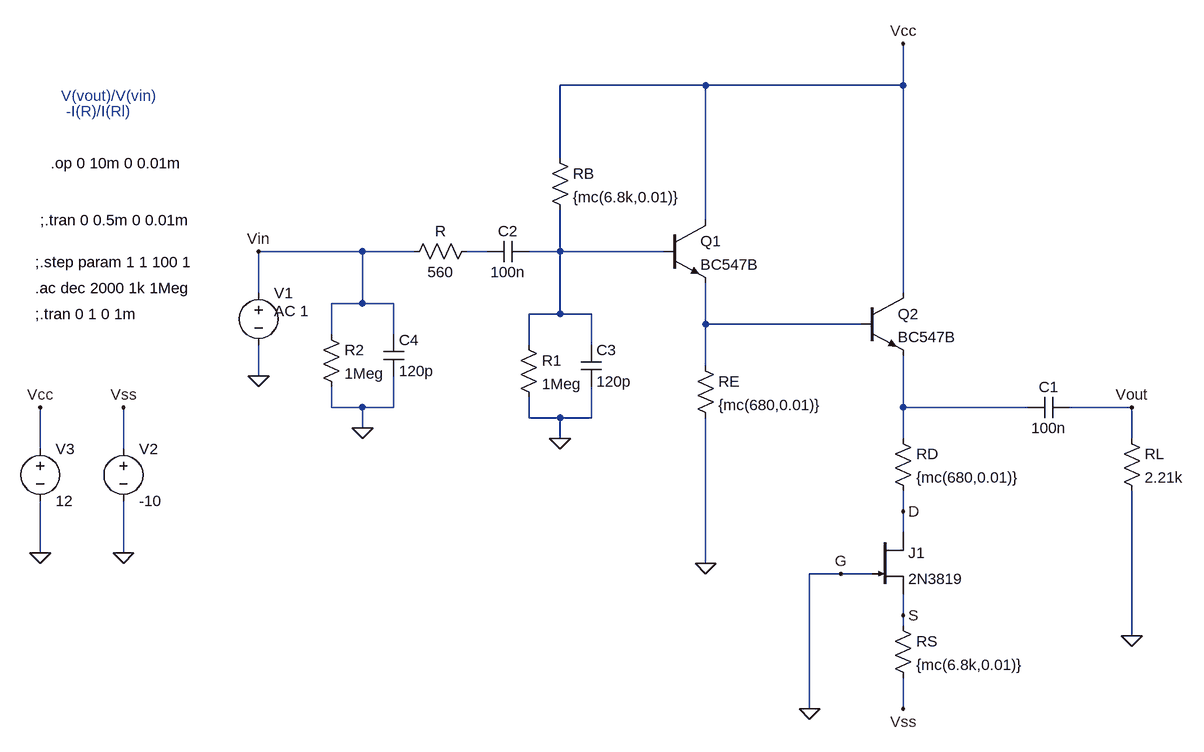
[diagram p0: schematic Darlington.asc]
Darlington.asc, the LTspice schematic file:
Version 4
SHEET 1 968 680
WIRE 192 -576 -32 -576
WIRE 496 -576 496 -640
WIRE 496 -576 192 -576
WIRE -32 -464 -32 -576
WIRE 192 -368 192 -576
WIRE -336 -320 -496 -320
WIRE -256 -320 -336 -320
WIRE -144 -320 -176 -320
WIRE -32 -320 -32 -384
WIRE -32 -320 -80 -320
WIRE 128 -320 -32 -320
WIRE -496 -256 -496 -320
WIRE 496 -256 496 -576
WIRE -336 -240 -336 -320
WIRE -336 -240 -384 -240
WIRE -288 -240 -336 -240
WIRE -32 -224 -32 -320
WIRE -32 -224 -80 -224
WIRE 16 -224 -32 -224
WIRE 192 -208 192 -272
WIRE 432 -208 192 -208
WIRE -384 -192 -384 -240
WIRE -288 -192 -288 -240
WIRE -80 -176 -80 -224
WIRE 16 -176 16 -224
WIRE 192 -144 192 -208
WIRE -496 -128 -496 -176
WIRE -384 -80 -384 -112
WIRE -336 -80 -384 -80
WIRE -288 -80 -288 -128
WIRE -288 -80 -336 -80
WIRE 496 -80 496 -160
WIRE 688 -80 496 -80
WIRE 848 -80 752 -80
WIRE -80 -64 -80 -96
WIRE -32 -64 -80 -64
WIRE 16 -64 16 -112
WIRE 16 -64 -32 -64
WIRE -336 -48 -336 -80
WIRE -32 -32 -32 -64
WIRE 496 -32 496 -80
WIRE 848 -32 848 -80
WIRE -832 -16 -832 -80
WIRE -704 -16 -704 -80
WIRE 496 80 496 48
WIRE 496 112 496 80
WIRE -832 144 -832 64
WIRE -704 144 -704 64
WIRE 192 160 192 -64
WIRE 400 176 352 176
WIRE 448 176 400 176
WIRE 496 240 496 208
WIRE 496 256 496 240
WIRE 848 272 848 48
WIRE 352 384 352 176
WIRE 496 384 496 336
FLAG 352 384 0
FLAG 496 384 Vss
FLAG -704 -80 Vss
FLAG -704 144 0
FLAG -832 -80 Vcc
FLAG -832 144 0
FLAG 496 -640 Vcc
FLAG 192 160 0
FLAG 848 272 0
FLAG -496 -128 0
FLAG -496 -320 Vin
FLAG 848 -80 Vout
FLAG 496 240 S
FLAG 496 80 D
FLAG 400 176 G
FLAG -32 -32 0
FLAG -336 -48 0
SYMBOL njf 448 112 R0
SYMATTR InstName J1
SYMATTR Value 2N3819
SYMBOL res 480 -48 R0
SYMATTR InstName RD
SYMATTR Value {mc(680,0.01)}
SYMATTR SpiceLine tol=1
SYMBOL res 480 240 R0
SYMATTR InstName RS
SYMATTR Value {mc(6.8k,0.01)}
SYMATTR SpiceLine tol=1
SYMBOL voltage -704 -32 R0
WINDOW 123 0 0 Left 0
WINDOW 39 0 0 Left 0
SYMATTR InstName V2
SYMATTR Value -10
SYMBOL npn 128 -368 R0
SYMATTR InstName Q1
SYMATTR Value BC547B
SYMBOL npn 432 -256 R0
SYMATTR InstName Q2
SYMATTR Value BC547B
SYMBOL res -48 -480 R0
SYMATTR InstName RB
SYMATTR Value {mc(6.8k,0.01)}
SYMATTR SpiceLine tol=1
SYMBOL res 176 -160 R0
SYMATTR InstName RE
SYMATTR Value {mc(680,0.01)}
SYMATTR SpiceLine tol=1
SYMBOL voltage -832 -32 R0
WINDOW 123 0 0 Left 0
WINDOW 39 0 0 Left 0
SYMATTR InstName V3
SYMATTR Value 12
SYMBOL cap 752 -96 R90
WINDOW 0 0 32 VBottom 2
WINDOW 3 32 32 VTop 2
SYMATTR InstName C1
SYMATTR Value 100n
SYMBOL res 832 -48 R0
SYMATTR InstName RL
SYMATTR Value 2.21k
SYMBOL res -160 -336 R90
WINDOW 0 0 56 VBottom 2
WINDOW 3 32 56 VTop 2
SYMATTR InstName R
SYMATTR Value 560
SYMBOL cap -80 -336 R90
WINDOW 0 0 32 VBottom 2
WINDOW 3 32 32 VTop 2
SYMATTR InstName C2
SYMATTR Value 100n
SYMBOL voltage -496 -272 R0
WINDOW 123 24 44 Left 2
WINDOW 39 0 0 Left 0
SYMATTR InstName V1
SYMATTR Value ""
SYMATTR Value2 AC 1
SYMBOL res -96 -192 R0
SYMATTR InstName R1
SYMATTR Value 1Meg
SYMBOL cap 0 -176 R0
SYMATTR InstName C3
SYMATTR Value 120p
SYMBOL res -400 -208 R0
SYMATTR InstName R2
SYMATTR Value 1Meg
SYMBOL cap -304 -192 R0
SYMATTR InstName C4
SYMATTR Value 120p
TEXT -840 -304 Left 2 !;.step param 1 1 100 1
TEXT -840 -224 Left 2 !;.tran 0 1 0 1m
TEXT -840 -264 Left 2 !.ac dec 2000 1k 1Meg
TEXT -800 -560 Left 2 ;V(vout)/V(vin)
TEXT -792 -536 Left 2 ;-I(R)/I(Rl)
TEXT -832 -368 Left 2 !;.tran 0 0.5m 0 0.01m
TEXT -816 -456 Left 2 !.op 0 10m 0 0.01m

The netlist it stands for:
* Darlington.asc
J1 D 0 S 2N3819
RD N004 D {mc(680,0.01)} tol=1
RS S Vss {mc(6.8k,0.01)} tol=1
V2 Vss 0 -10
Q1 Vcc N002 N003 0 BC547B
Q2 Vcc N003 N004 0 BC547B
RB Vcc N002 {mc(6.8k,0.01)} tol=1
RE N003 0 {mc(680,0.01)} tol=1
V3 Vcc 0 12
C1 Vout N004 100n
RL Vout 0 2.21k
R N001 Vin 560
C2 N002 N001 100n
V1 Vin 0 AC 1
R1 N002 0 1Meg
C3 N002 0 120p
R2 Vin 0 1Meg
C4 Vin 0 120p
.model NPN NPN
.model PNP PNP
.lib standard.bjt
.model NJF NJF
.model PJF PJF
.lib standard.jft
;.step param 1 1 100 1
;.tran 0 1 0 1m
.ac dec 2000 1k 1Meg
* V(vout)/V(vin)
* -I(R)/I(Rl)
;.tran 0 0.5m 0 0.01m
.op 0 10m 0 0.01m
.backanno
.end